# EAGLE schematic Plan_SpaStroWi (EAGLE 7.7.0)
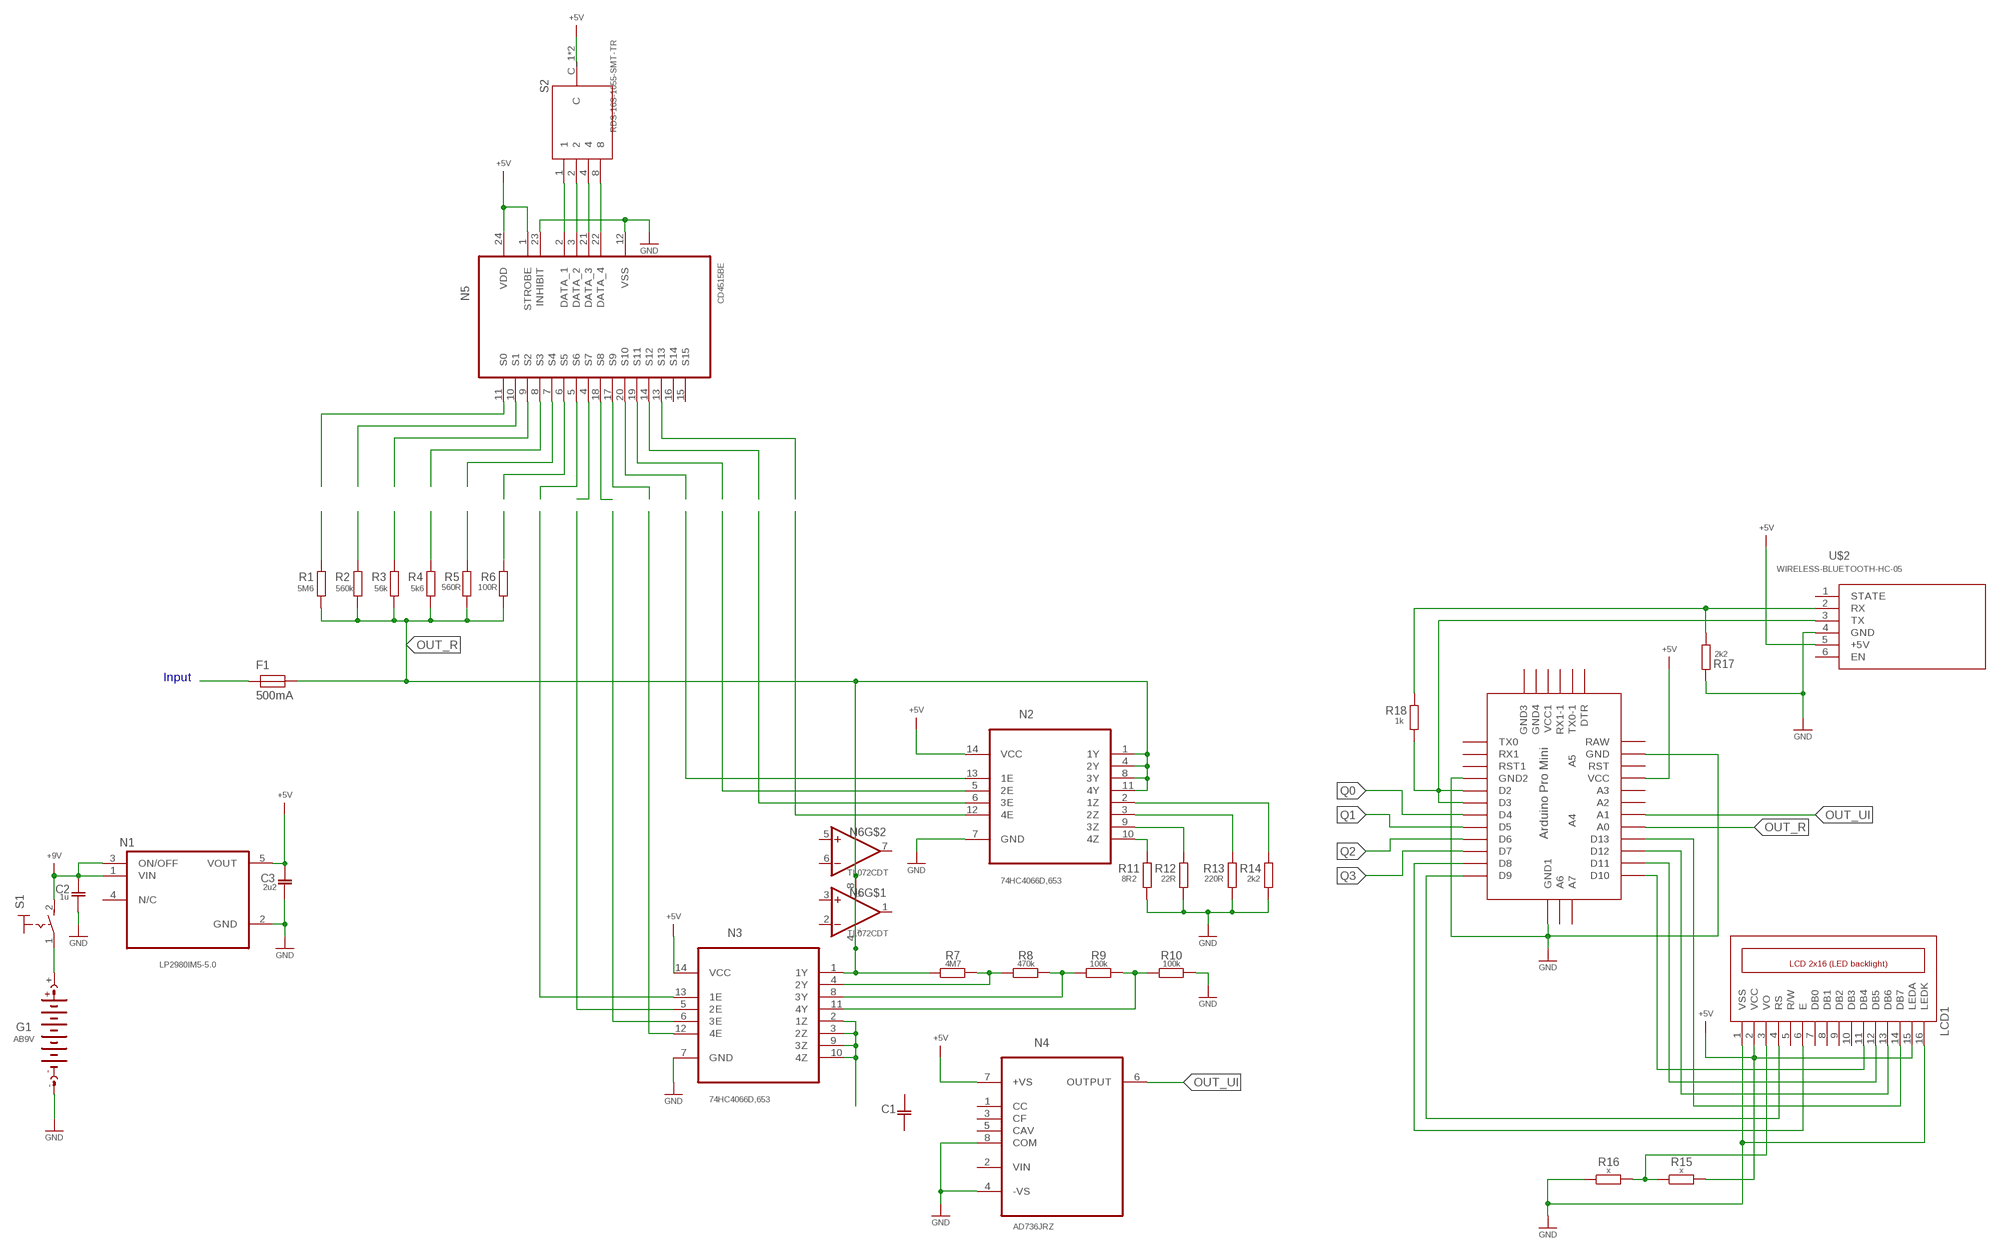
[diagram p0: schematic, sheet 1]

## Parts
C1  C-EU025-025X050  [C025-025X050]
C2  1u  C-EUC0805  [C0805]
C3  2u2  C-EUC0805  [C0805]
F1  500mA  500MXP  [354-0101ZXGY]
G1  AB9V  [AB9V]
LCD1  LCD_2X16_SIL  [HY-1602F]
N1  LP2980IM5-5.0  [SOT95P280X145-5N]
N2  74HC4066D,653  [SOIC127P600X175-14N]
N3  74HC4066D,653  [SOIC127P600X175-14N]
N4  AD736JRZ  [SOIC127P600X175-8N]
N5  CD4515BE  [SOIC127P1030X265-24N]
N6  TL072CDT  [SOIC127P600X175-8N]
R1  5M6  R-EU_R0805  [R0805]
R2  560k  R-EU_R0805  [R0805]
R3  56k  R-EU_R0805  [R0805]
R4  5k6  R-EU_R0805  [R0805]
R5  560R  R-EU_R0805  [R0805]
R6  100R  R-EU_R0805  [R0805]
R7  4M7  R-EU_R0805  [R0805]
R8  470k  R-EU_R0805  [R0805]
R9  100k  R-EU_R0805  [R0805]
R10  100k  R-EU_R0805  [R0805]
R11  8R2  R-EU_R0805  [R0805]
R12  22R  R-EU_R0805  [R0805]
R13  220R  R-EU_R0805  [R0805]
R14  2k2  R-EU_R0805  [R0805]
R15  x  R-EU_R0805  [R0805]
R16  x  R-EU_R0805  [R0805]
R17  2k2  R-EU_R0805  [R0805]
R18  1k  R-EU_R0805  [R0805]
S1  MS243  [MS243]
S2  RDS-16S-1055-SMT-TR  [SW_RDS-16S-1055-SMT-TR]
U$1  ABK-PRO-MINI  [ABK-PRO-MINI]
U$2  WIRELESS-BLUETOOTH-HC-05  [WIRELESS-BLUETOOTH-HC-05]

## Nets
+5V: C3.1 LCD1.2(VCC) LCD1.15(LEDA) N1.5(VOUT) N2.14(VCC) N3.14(VCC) N4.7(+VS) N5.1(STROBE) N5.24(VDD) R15.2 S2.C_1(C) S2.C_2(C) U$1.VCC U$2.5(+5V)
+9V: C2.1 N1.1(VIN) N1.3(ON/OFF) S1.2(S)
GND: C3.2 G1.- LCD1.1(VSS) LCD1.16(LEDK) N1.2(GND) N2.7(GND) N3.7(GND) N4.4(-VS) N4.8(COM) N5.12(VSS) N5.23(INHIBIT) R10.2 R11.1 R12.1 R13.1 R14.1 R16.1 R17.2 U$1.GND U$1.GND1(GND2) U$1.GND4(GND1) U$2.4(GND)
N$1: R1.2
N$2: R2.2
N$3: R3.2
N$4: R4.2
N$5: R5.2
N$6: R6.2
N$7: N5.11(S0)
N$8: N3.5(2E)
N$9: N3.2(1Z) N3.3(2Z) N3.9(3Z) N3.10(4Z)
N$11: G1.+ S1.1(P)
N$12: N2.10(4Z) R11.2
N$13: N2.9(3Z) R12.2
N$14: N3.6(3E)
N$15: N3.12(4E)
N$16: N2.13(1E)
N$17: N2.5(2E)
N$18: N2.6(3E)
N$19: N2.12(4E)
N$20: N3.8(3Y) R8.2 R9.1
N$21: N2.3(2Z) R13.2
N$22: N2.2(1Z) R14.2
N$23: N3.11(4Y) R9.2 R10.1
N$24: N3.4(2Y) R7.2 R8.1
N$25: C2.2 ; supply symbol labelled GND
N$26: R18.1 U$1.D3 U$2.3(TX)
N$27: N5.10(S1)
N$28: N5.9(S2)
N$29: N5.8(S3)
N$30: LCD1.11(DB4) U$1.D10
N$31: LCD1.3(VO) R15.1 R16.2
N$32: LCD1.12(DB5) U$1.D11
N$33: LCD1.13(DB6) U$1.D12
N$34: N5.7(S4)
N$35: N5.6(S5)
N$36: N5.5(S6)
N$37: N5.4(S7)
N$38: N5.18(S8)
N$39: N5.17(S9)
N$40: LCD1.14(DB7) U$1.D13
N$41: LCD1.4(RS) U$1.D9
N$42: LCD1.6(E) U$1.D8
N$43: R17.1 R18.2 U$2.2(RX)
N$44: U$1.D2
N$45: N5.20(S10)
N$46: N3.13(1E)
N$47: N5.19(S11)
N$48: N5.14(S12)
N$49: N5.13(S13)
N$50: N5.2(DATA_1) S2.1
N$51: N5.3(DATA_2) S2.2
N$52: N5.21(DATA_3) S2.4
N$53: N5.22(DATA_4) S2.8
OUT_R: F1.2 N2.1(1Y) N2.4(2Y) N2.8(3Y) N2.11(4Y) N3.1(1Y) N6.4(V-) N6.8(V+) R1.1 R2.1 R3.1 R4.1 R5.1 R6.1 R7.1 U$1.A0
OUT_UI: N4.6(OUTPUT) U$1.A1
Q0: U$1.D4
Q1: U$1.D5
Q2: U$1.D6
Q3: U$1.D7
Unconnected: C1.1 C1.2 F1.1 LCD1.5(R/W) LCD1.7(DB0) LCD1.8(DB1) LCD1.9(DB2) LCD1.10(DB3) N1.4(N/C) N4.1(CC) N4.2(VIN) N4.3(CF) N4.5(CAV) N5.15(S15) N5.16(S14) N6.1(OUT1) N6.2(-IN1) N6.3(+IN1) N6.5(+IN2) N6.6(-IN2) N6.7(OUT2) U$1.A2 U$1.A3 U$1.A4 U$1.A5 U$1.A6 U$1.A7 U$1.DTR U$1.GND2(GND3) U$1.GND3(GND4) U$1.RAW U$1.RST U$1.RST1 U$1.RX1 U$1.RX1-1 U$1.TX0 U$1.TX0-1 U$1.VCC1 U$2.1(STATE) U$2.6(EN)

## Notes on the sheet
- Input

## Library data of the parts
C1-C3 = rcl_HipL:C-EU: CAPACITOR, European symbol
F1 = fuse_HipL:500MXP: Littelfuse 0508.500MXP FUSE 1000V 3AB FAST CERM .500A, mounted with Littelfuse 0354 0101ZXGY 354 Series OMMI-BLOK® Molded Base Fuse Block for 3AG Fuses. Check prices <https://pricing.snapeda.com/parts/0508.500MXP/Littelfuse/view-part?ref=eda>; AVAILABILITY: Warning; DESCRIPTION: 500mA 1kV AC 1000V DC Fuse Cartridge, Ceramic Holder 3AB, 3AG, 1/4 x 1-1/4; MF: Littelfuse; MP: 0508.500MXP; PACKAGE: 3AB-1 Littelfuse; PRICE: None; PURCHASE-URL: https://pricing.snapeda.com/search/part/0508.500MXP/?ref=eda
G1 = battery_HTBL:AB9V: 9-V BATTERY CLIP
LCD1 = Module_uC:LCD_2X16_SIL
N1 = ic-vreg_HipL:LP2980IM5-5.0: Check prices <https://pricing.snapeda.com/parts/LP2980IM5-5.0/NOPB/Texas%20Instruments/view-part?ref=eda>; AVAILABILITY: Warning; DESCRIPTION: 50-mA, 16-V, low-dropout voltage regulator with enable 5-SOT-23 -40 to 125; MF: Texas Instruments; MP: LP2980IM5-5.0/NOPB; PACKAGE: SOT-23-5 Texas Instruments; PRICE: None; PURCHASE-URL: https://pricing.snapeda.com/search/part/LP2980IM5-5.0/NOPB/?ref=eda
N2 N3 = Transistor_HipL:74HC4066D,653: Quad bilateral switches Check prices <https://pricing.snapeda.com/parts/74HC4066D%2C653/Nexperia/view-part?ref=eda>; AVAILABILITY: Good; DESCRIPTION: 4 Circuit IC Switch 1:1 95Ohm 14-SO; MF: Nexperia; MP: 74HC4066D,653; PACKAGE: SO14-14 Nexperia USA Inc.; PRICE: None; PURCHASE-URL: https://pricing.snapeda.com/search/part/74HC4066D,653/?ref=eda
N4 = ic-other_HipL:AD736JRZ: Low Cost, Low Power,True RMS-to-DC Converter Check prices <https://pricing.snapeda.com/parts/AD736JRZ/Analog%20Devices%20Inc./view-part?ref=eda>; AVAILABILITY: Good; DESCRIPTION: IC RMS TO DC CONVERTER 8SOIC; MF: Analog Devices Inc.; MP: AD736JRZ; PACKAGE: None; PRICE: None; PURCHASE-URL: https://pricing.snapeda.com/search/part/AD736JRZ/?ref=eda
N5 = ic-logik_HipL:CD4515BE: CMOS 4-BIT LATCH/4-TO-16 LINE DECODERS Check prices <https://pricing.snapeda.com/parts/CD4515BE/Texas/view-part?ref=eda>
N6 = ic-linear_HipL:TL072CDT: Low Noise JFET dual operational amplifiers Check prices <https://pricing.snapeda.com/parts/TL072CD/Texas%20Instruments/view-part?ref=eda>; AVAILABILITY: Good; DESCRIPTION: Dual Low-Noise JFET-Input General-Purpose Operational Amplifier 8-SOIC 0 to 70; MF: Texas Instruments; MP: TL072CD; PACKAGE: SOIC-8 Texas Instruments; PRICE: None; PURCHASE-URL: https://pricing.snapeda.com/search/part/TL072CD/?ref=eda
R1-R18 = rcl_HipL:R-EU_: RESISTOR, European symbol
S1 = switch:MS243: TOGGLE SWITCH
S2 = switch_HipL:RDS-16S-1055-SMT-TR: Rotary Dip Switch Check prices <https://pricing.snapeda.com/parts/RDS-16S-1055-SMT-TR/CUI%20Devices/view-part?ref=eda>; AVAILABILITY: Warning; CUI_PURCHASE_URL: https://www.cuidevices.com/product/switches/dip-switches/rds-1055-smt-series?utm_source=snapeda.com&utm_medium=referral&utm_campaign=snapedaBOM; DESCRIPTION: 10 and 16 Positions, Surface Mount, 2.54 mm Pitch, Rotary Actuator, DIP Switch; MF: CUI Devices; MP: RDS-16S-1055-SMT-TR; PACKAGE: Package; PRICE: None; PURCHASE-URL: https://pricing.snapeda.com/search/part/RDS-16S-1055-SMT-TR/?ref=eda
U$1 = Module_uC:ABK-PRO-MINI: ABK Pro-Mini Arduino Clone
U$2 = Module_uC:WIRELESS-BLUETOOTH-HC-05: Bluetooth Transceiver Module based on HC-05 board Tutorial is available here: https://arduino-info.wikispaces.com/BlueTooth-HC05-HC06-Modules-How-To Click here to find device on ebay.com <http://www.ebay.com/sch/hc-05+module+rs232>